# Altium schematic sheet Power.SchDoc
size A4
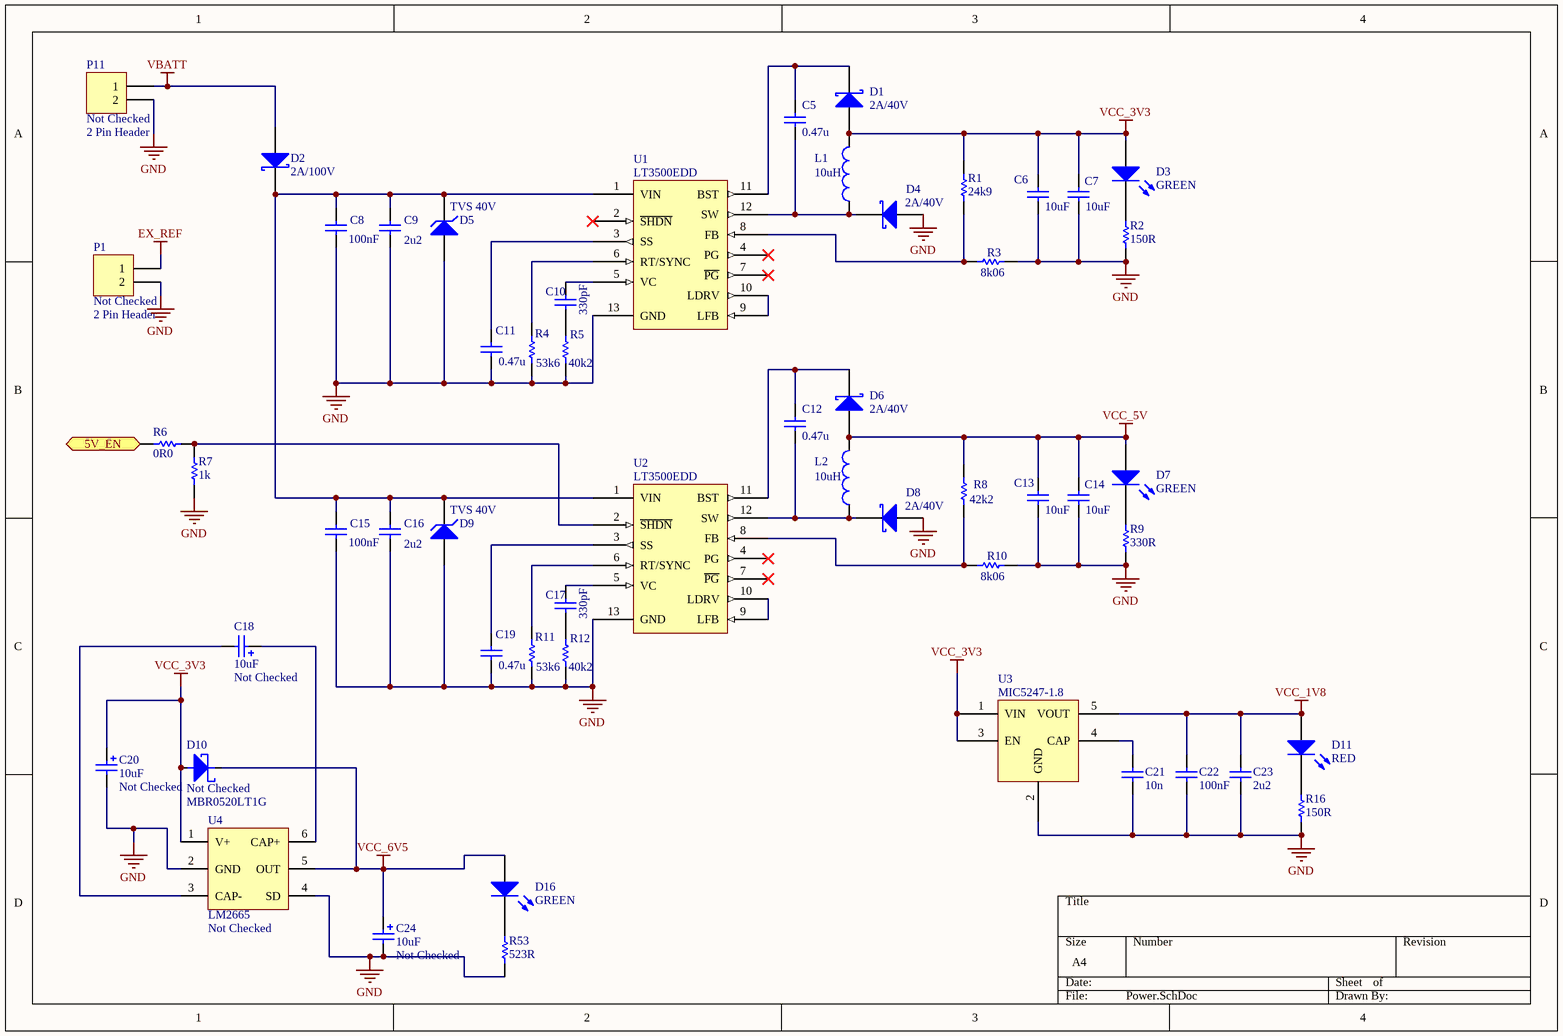
[diagram p0: Power.SchDoc]

## Parts
C5  value 0.47u  [0603]  (hidden comment: CP_470n 0603 25V X5R)
C6  10uF  [0805]
C7  10uF  [0805]
C8  100nF  [0603]
C9  value 2u2  [1206]  (hidden comment: CP_2u2 1206)
C10  value 330pF  [0603]  (hidden comment: CP_330pF 0603)
C11  value 0.47u  [0603]  (hidden comment: CP_470n 0603 25V X5R)
C12  value 0.47u  [0603]  (hidden comment: CP_470n 0603 25V X5R)
C13  10uF  [0805]
C14  10uF  [0805]
C15  100nF  [0603]
C16  value 2u2  [1206]  (hidden comment: CP_2u2 1206)
C17  value 330pF  [0603]  (hidden comment: CP_330pF 0603)
C18  Verify: Not Checked  [1206P]  (hidden comment: 10uF)
C19  value 0.47u  [0603]  (hidden comment: CP_470n 0603 25V X5R)
C20  Verify: Not Checked  [1206P]  (hidden comment: 10uF)
C21  10n  [0603]
C22  100nF  [0603]
C23  value 2u2  [1206]  (hidden comment: CP_2u2_50V_1206)
C24  Verify: Not Checked  [1206P]  (hidden comment: 10uF)
D1  2A/40V  [SMA_DIODE]
D2  2A/100V  [SMB_DIODE]
D3  value GREEN  [Diode_0805]  (hidden comment: LED Green)
D4  2A/40V  [SMA_DIODE]
D5  TVS 40V  [SMB_DIODE]
D6  2A/40V  [SMA_DIODE]
D7  value GREEN  [Diode_0805]  (hidden comment: LED Green)
D8  2A/40V  [SMA_DIODE]
D9  TVS 40V  [SMB_DIODE]
D10  Verify: Not Checked  [SOD123]  (hidden comment: MBR0520LT1G)
D11  value RED  [Diode_0805]  (hidden comment: LED Red)
D16  value GREEN  [Diode_0805]  (hidden comment: LED Green)
L1  10uH  [WE-PD]
L2  10uH  [WE-PD]
P1  Verify: Not Checked  [CONN_2X1_SMT_RA_1.25MM]  (hidden comment: 2 Pin Header)
P11  Verify: Not Checked  [POWER_PADS]  (hidden comment: 2 Pin Header)
R1  24k9  [0603]
R2  150R  [0603]
R3  8k06  [0603]
R4  53k6  [0603]
R5  40k2  [0603]
R6  0R0  [0603]  (no BOM)
R7  1k  [0603]
R8  42k2  [0603]
R9  330R  [0603]
R10  8k06  [0603]
R11  53k6  [0603]
R12  40k2  [0603]
R16  150R  [0603]
R53  523R  [0603]
U1  value LT3500EDD  [12-DFN]  (hidden comment: IC_LT3500EDD)
U2  value LT3500EDD  [12-DFN]  (hidden comment: IC_LT3500EDD)
U3  MIC5247-1.8  [SOT23-5]
U4  Verify: Not Checked  [SOT23-6]  (hidden comment: LM2665)

## Ports
5V_EN (in)

## Nets
EX_REF: P1.1
GND: C6.2 C7.2 C8.1 C9.2 C11.2 C13.2 C14.2 C15.1 C16.2 C19.2 C20.2 C21.1 C22.1 C23.1 C24.2 D4.1(A) D5.1(A) D8.1(A) D9.1(A) P1.2 P11.2 R2.1 R3.1 R4.1 R5.1 R7.1 R9.1 R10.1 R11.1 R12.1 R16.1 R53.2 U1.13(GND) U2.13(GND) U3.2(GND) U4.2(GND) U4.4(SD)
VBATT: D2.1(A) P11.1
VCC_1V8: C22.2 C23.2 D11.1(A) U3.5(VOUT)
VCC_3V3: C6.1 C7.1 C20.1 D1.1(A) D3.1(A) D10.1(A) L1.2 R1.2 U3.1(VIN) U3.3(EN) U4.1(V+)
VCC_5V: C13.1 C14.1 D6.1(A) D7.1(A) L2.2 R8.2
VCC_6V5: C24.1 D10.2(K) D16.1(A) U4.5(OUT)
5V_EN: R6.2 ; port 5V_EN
NetC5_1: C5.1 D4.2(K) L1.1 U1.12(SW)
NetC5_2: C5.2 D1.2(K) U1.11(BST)
NetC8_2: C8.2 C9.1 C15.2 C16.1 D2.2(K) D5.2(K) D9.2(K) U1.1(VIN) U2.1(VIN)
NetC10_1: C10.1 U1.5(VC)
NetC10_2: C10.2 R5.2
NetC11_1: C11.1 U1.3(SS)
NetC12_1: C12.1 D8.2(K) L2.1 U2.12(SW)
NetC12_2: C12.2 D6.2(K) U2.11(BST)
NetC17_1: C17.1 U2.5(VC)
NetC17_2: C17.2 R12.2
NetC18_1: C18.1 U4.6(CAP+)
NetC18_2: C18.2 U4.3(CAP-)
NetC19_1: C19.1 U2.3(SS)
NetC21_2: C21.2 U3.4(CAP)
NetD3_2: D3.2(K) R2.2
NetD7_2: D7.2(K) R9.2
NetD11_2: D11.2(K) R16.2
NetD16_2: D16.2(K) R53.1
NetR1_1: R1.1 R3.2 U1.8(FB)
NetR4_2: R4.2 U1.6(RT/SYNC)
NetR6_1: R6.1 R7.2 U2.2(~{SHDN})
NetR8_1: R8.1 R10.2 U2.8(FB)
NetR11_2: R11.2 U2.6(RT/SYNC)
NetU1_9: U1.9(LFB) U1.10(LDRV)
NetU2_9: U2.9(LFB) U2.10(LDRV)

Not connected (* = marked no-connect by the designer): U1 2(~{SHDN})* 4(PG)* 7(~{PG})*; U2 4(PG)* 7(~{PG})*

## Library data of the parts
C5 C11 C12 C19 = CP_470n 0603 25V X5R: CAP CER .47UF 25V X5R 0603; Manufacturer: Taiyo Yuden; Manufacturer PN: TMK107BJ474KA-T; Prototype: Digikey 587-1247-1-ND; Published: 8-Jun-2000; LatestRevisionDate: 17-Jul-2002; LatestRevisionNote: Re-released for DXP Platform.; PackageReference: RAD-0.3; Publisher: Altium Limited
C6 C7 C13 C14 = CP_10uF 0805: CAP 10uF 10% 10V X5R 0805; Manufacturer: Murata; Manufacturer PN: GRM219R61A106KE44D; Prototype: Digikey 490-4735-2-ND; LatestRevisionDate: 29 May 08; Value: 10uF
C8 C15 C21 C22 = CP_100nF 0603: CAP CER .10UF 50V X5R 0603; Manufacturer: Taiyo Yuden; Manufacturer PN: UMK107B7104KA-T; Prototype: Digikey 587-1243-1-ND; LatestRevisionDate: 29 May 08
  C8 C15 C22: Value: 100nF
  C21: Value: 10n
C9 C16 = CP_2u2 1206: CAP CER 2u2 50V Y5V 1206; Manufacturer: Taiyo Yuden; Manufacturer PN: UMK316F225ZG-T; Prototype: Digikey 587-1351-1-ND; LatestRevisionDate: 29 May 08
C10 C17 = CP_330pF 0603: CAP 330PF 50V CERAMIC X7R 0603; Manufacturer: Yageo; Manufacturer PN: CC0603KRX7R9BB331; Prototype: Digikey 311-1186-1-ND; LatestRevisionDate: 17-Jul-2002
C18 C20 C24 = CP_TANT_10uF_1206: CAP 10uF 20% 10V 300mOhm 1206; Manufacturer: AVX; Manufacturer PN: TCJA106M010R0300; Prototype: Digikey 478-3127-1-ND; Modified Date: 11 Jun 09; LatestRevisionDate: 11 Jun 09; Value: 10uF
C23 = CP_2u2_50V_1206: CAP CER 2u2 50V Y5V 1206; Manufacturer: Taiyo Yuden; Manufacturer PN: UMK316F225ZG-T; Prototype: Digikey 587-1351-1-ND; LatestRevisionDate: 29 May 08
D1 D4 D6 D8 = DS_B240A-13-F: Schottky Diode - 2A/40V; Manufacturer: Diodes Inc; Prototype: DigiKey B240A-FDICT-ND; LatestRevisionDate: 29 May 08; Value: 2A/40V; Manufacturer PN: B240A-13-F
D2 = DS_SS2H10-E3/52T: Schottky Diode - 2A/100V; Manufacturer: Vishay/General Semiconductor; Prototype: DigiKey SS2H10-E3/52TGICT-ND; LatestRevisionDate: 29 may 08; Value: 2A/100V; Manufacturer PN: SS2H10-E3/52T
D3 D7 D16 = DL_LED Green 0805: Green LED 0805; Prototype: Digikey 751-1166-1-ND; Verify: Not checked; DigiKey: TLMG2100-GS08; Category: Vishay
D5 D9 = DZ_40v TVS: DIODE TVS 40V 600W UNIDIR  SMB; Manufacturer: LittelFuse; Manufacturer PN: SMBJ36A; Prototype: Digikey   SMBJ36ALFCT-ND; LatestRevisionDate: 29 May 08; Value: TVS 40V
D10 = DS_MBR0520LT1G: DIODE SCHOTTKY 20V 0.5A SOD123; Manufacturer: ON Semiconductor; Prototype: Digikey MBR0520LT1GOSCT-ND; Value: MBR0520LT1G; Manufacturer PN: MBR0520LT1G
D11 = DL_LED 1.7V Red 0805: Red LED 1.7V 0805; Manufacturer PN: 7012X1; Manufacturer: CML; Prototype: Digikey L61101CT-ND
L1 L2 = IN_10uH 2A SMT: INDUCTOR POWER 10UH 2.0A SMD; Manufacturer: Wurth Electronics Inc; Manufacturer PN: 744777910; Prototype: Digikey 732-1191-1-ND; LatestRevisionDate: 29 May 08; Value: 10uH
P1 = JP_2PIN HDR_SMT_RA_MOLEX: CONN HDR VERT 2POS .100" SNGL; Manufacturer: Molex; Manufacturer PN: 53261-0271; Prototype: Digikey WM7620CT-ND; LatestRevisionDate: 24 Jun 08; Value: 2 Pin Header
P11 = JP_2PIN HDR_SMT_RA_MOLEX: LatestRevisionDate: 24 Jun 08; Value: 2 Pin Header
R1 = RS_24k9 0603: RES 24.9K OHM 1/10W 1% 0603 SMD; Manufacturer: ROHM; Manufacturer PN: MCR03EZPFX2492; Prototype: DigiKey RHM24.9KHCT-ND; LatestRevisionDate: 29 May 08; Value: 24k9
R2 = RS_150R 0603: RES 150 OHM 1/10W 1% 0603 SMD; Manufacturer: ROHM; Manufacturer PN: MCR03EZPFX1500; Prototype: DigiKey RHM150HCT-ND; LatestRevisionDate: 4th July 08; Value: 150R
R3 R10 = RS_8k06 0603: RES 8k06 OHM 1/10W 1% 0603 SMD; Manufacturer: ROHM; Manufacturer PN: MCR03EZPFX8061; Prototype: DigiKey RHM8.06KHCT-ND; LatestRevisionDate: 29 May 08; Value: 8k06
R4 R11 = RS_53k6 0603: RES 53.6K OHM 1/10W 1% 0603 SMD; Manufacturer: ROHM; Manufacturer PN: MCR03EZPFX5362; Prototype: DigiKey RHM53.6KHCT-ND; LatestRevisionDate: 29 May 08; Value: 53k6
R5 R12 = RS_40k2 0603: RES 40.2K OHM 1/10W 1% 0603 SMD; Manufacturer: ROHM; Manufacturer PN: MCR03EZPFX4022; Prototype: Digikey RHM40.2KHCT-ND; LatestRevisionDate: 29 May 08; Value: 40k2
R6 = RS_0R0 0603: RES 0.0 OHM 1/10W 5% 0603 SMD; Manufacturer: Rohm; Manufacturer PN: MCR03EZPJ000; Prototype: DigiKey RHM0.0GCT-ND; LatestRevisionDate: 3 Jun 08; Value: 0R0
R7 = RS_1k 0603: RES 1.00K OHM 1/10W 1% 0603 SMD; Manufacturer: ROHM; Manufacturer PN: MCR03EZPFX1001; Prototype: Digikey RHM1.00KHCT-ND; LatestRevisionDate: 17-Jul-2002; Value: 1k
R8 = RS_42k2 0603: RES 42.2K OHM 1/10W 1% 0603 SMD; Manufacturer: ROHM; Manufacturer PN: MCR03EZPFX4222; Prototype: DigiKey RHM42.2KHCT-ND; LatestRevisionDate: 29 May 08; Value: 42k2
R9 = RS_330R 0603: RES 330 OHM 1/10W 1% 0603 SMD; Manufacturer: Yageo; Manufacturer PN: RC0603FR-07330RL; Prototype: DigiKey 311-330HRCT-ND; LatestRevisionDate: 25 June 2009; Value: 330R
R16 = RS_100k 0603: RES 100K OHM 1/10W 1% 0603 SMD; Manufacturer: Yageo; Manufacturer PN: RC0603FR-07100KL; Prototype: DigiKey 311-100KHRCT-ND; LatestRevisionDate: 1 Jun 08; Value: 150R
R53 = RS_523R 0603: RES 523 OHM 1/10W 1% 0603 SMD; Manufacturer: Yageo; Manufacturer PN: RC0603FR-07523RL; Prototype: DigiKey 311-523HRCT-ND; LatestRevisionDate: 25 June 2009; Value: 523R
U1 U2 = IC_LT3500EDD: IC REG STP-DWN 2A 12-DFN; Manufacturer: Linear Technology; Manufacturer PN: LT3500EDD#PBF; Prototype: DigiKey LT3500EDD#PBF-ND; Published: 24-Mar-1999; LatestRevisionDate: 17-Jul-2002; LatestRevisionNote: Re-released for DXP Platform.; PackageReference: SPST-2; Publisher: Altium Limited
U3 = IC_MIC5247-1.8YM5: 1.8V linear regulator; Manufacturer: Micrel; Manufacturer PN: MIC5247-1.8YM5 TR; Prototype: Digikey 576-1288-1-ND; LatestRevisionDate: 25 June 2009
U4 = IC_LM2665: Switched Capacitor Voltage Converter; Manufacturer: National Semiconductor; Manufacturer PN: LM2665M6/NOPB; Prototype: Digikey LM2665M6CT-ND; LatestRevisionDate: 11 June 09; Value: LM2665